# Altium schematic sheet DC.SchDoc: param:Title (part 2 of 3)
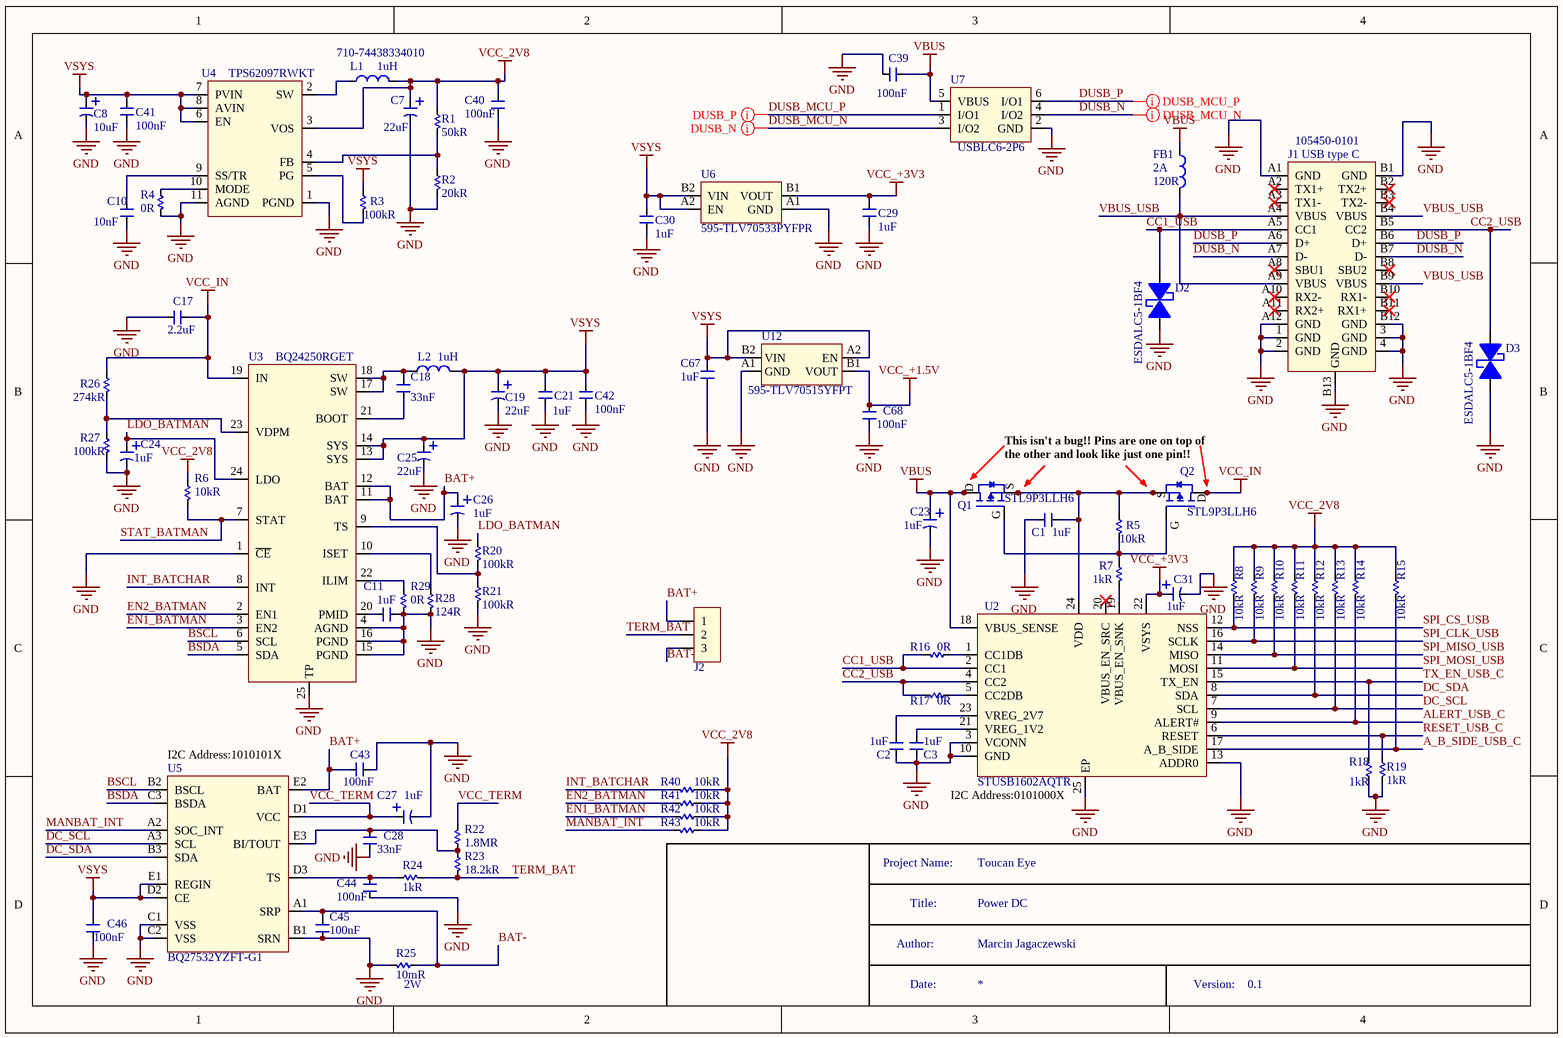
[diagram p1: DC.SchDoc]
## Library data of the parts
C1-C3 C11 C21 C29 C30 C67 = C0402_1uF_TMK105BJ105MV-F: CAP CER 1UF 25V X5R 0402; Manufacturer: Taiyo Yuden; Tolerance: 20%; *PCBChecked: 1; Supplier 1: Mouser; Manufacturer Part Number: TMK105BJ105MV-F; Stock 1: 60117; Pricing 1: 1=0.28, 10=0.098, 50=0.098, 100=0.054, 1000=0.028, 10000=0.019 (USD); Mount: Surface Mount; Case/Package: 0402; Case Code (Metric): 1005; Case Code (Imperial): 0402; Min Operating Temperature: -55°C; Max Operating Temperature: 85°C; Packaging: Tape and Reel; Package Quantity: 1; Voltage Rating (DC): 25V; Dielectric: X5R; Termination: SMD/SMT; Voltage Rating: 25V; Composition: Ceramic; Length: 1mm; Height: 0.5mm; Width: 0.02inch; Thickness: 0.022inch; Depth: 0.5mm; Radiation Hardening: No; Halogen Free: Halogen Free; ComponentLink1URL: https://datasheet.ciiva.com/30154/128tmk105bj105mv-f-30154639.pdf; ComponentLink1Description: https://datasheet.ciiva.com/30154/128tmk105bj105mv-f-30154639.pdf; ComponentLink2URL: https://datasheet.ciiva.com/15922/tmk105bj105mv-f-pdf-15922317.pdf; ComponentLink2Description: https://datasheet.ciiva.com/15922/tmk105bj105mv-f-pdf-15922317.pdf; ComponentLink3URL: https://datasheet.ciiva.com/11596/tmk105bj105mv-f-ss-11596466.pdf; ComponentLink3Description: https://datasheet.ciiva.com/11596/tmk105bj105mv-f-ss-11596466.pdf; ComponentLink4URL: https://datasheet.ciiva.com/13404/mlcc-all-e-541559-13404206.pdf; ComponentLink4Description: https://datasheet.ciiva.com/13404/mlcc-all-e-541559-13404206.pdf; *SCHChecked: 1; Supplier Part Number 1: 963-TMK105BJ105MV-F
C7 C19 C25 = C_22u_TANTAL_A_T491A226K006AT: Cap Tant Solid 22uF 6.3V A CASE 10% (3.2 X 1.6 X 1.6mm) SMD 3216-18 4 Ohm 125C T/R; Manufacturer: KEMET; Dielectric Material: Tantalum; ESR (Equivalent Series Resistance): 4R; Ripple Current: 137mA; Leakage Current: 1.4uA; Polarity: Polar; Dissipation Factor: 6%; Life (Hours): 2000Hour; *PCBChecked: 1; Supplier 1: Mouser; Manufacturer Part Number: T491A226K006AT; Stock 1: 2818; Pricing 1: 1=0.42, 10=0.239, 50=0.239, 100=0.144, 1000=0.118, 10000=0.08 (USD); Mount: Surface Mount,PCB; Case/Package: 1206; Number of Pins: 2; Case Code (Metric): 3216; Case Code (Imperial): 1206; Min Operating Temperature: -55°C; Max Operating Temperature: 125°C; Tolerance: 10%; Packaging: Tape and Reel; Voltage Rating: 6.3V; Package Quantity: 1; Failure Rate: 0.001%; Termination: SMD/SMT; Voltage: 6.3V; Voltage Rating (DC): 6.3V; Length: 3.2mm; Height: 1.6mm; Depth: 1.6mm; Width: 0.063inch; Height - Seated (Max): 0.071inch; Lead Pitch: 1.2mm; Radiation Hardening: No; Lead Free: Lead Free; REACH SVHC: No SVHC; ComponentLink1URL: https://datasheet.ciiva.com/12884/kem-t2005-t491-12884456.pdf; ComponentLink1Description: https://datasheet.ciiva.com/12884/kem-t2005-t491-12884456.pdf; ComponentLink2URL: https://datasheet.ciiva.com/6248/kem-t2005-t491-6248094.pdf; ComponentLink2Description: https://datasheet.ciiva.com/6248/kem-t2005-t491-6248094.pdf; ComponentLink3URL: https://datasheet.ciiva.com/28488/1854511-28488485.pdf; ComponentLink3Description: https://datasheet.ciiva.com/28488/1854511-28488485.pdf; ComponentLink4URL: https://datasheet.ciiva.com/5934/kem-t2005-t491-5934246.pdf; ComponentLink4Description: https://datasheet.ciiva.com/5934/kem-t2005-t491-5934246.pdf; *SCHChecked: 1; Supplier Part Number 1: 80-T491A226K006
C8 = C_10u_TANTAL_A_T491A106K010AT7280: CAP TANT 10UF 10V 10% 1206; Manufacturer: KEMET; ESR (Equivalent Series Resistance): 3.8R; Polarity: Polar; Dissipation Factor: 6%; Life (Hours): 2000Hour; Supplier 1: Mouser; Manufacturer Part Number: T491A106K010AT7280; Stock 1: 0; Pricing 1: 1=0.39, 10=0.223, 50=0.223, 100=0.134, 1000=0.096, 10000=0.074 (USD); Mount: Surface Mount; Case/Package: 1206; Case Code (Metric): 3216; Case Code (Imperial): 1206; Min Operating Temperature: -55°C; Max Operating Temperature: 125°C; Tolerance: 10%; Packaging: Tape and Reel; Voltage Rating: 10V; Package Quantity: 1; Termination: SMD/SMT; Resistance: 3.8R; Failure Rate: 0.001%; Length: 3.2mm; Height: 1.8mm; Depth: 1.6mm; Width: 0.063inch; Height - Seated (Max): 0.071inch; Lead Free: Lead Free; ComponentLink1URL: https://datasheet.ciiva.com/12911/kem-t2005-t491-12911022.pdf; ComponentLink1Description: https://datasheet.ciiva.com/12911/kem-t2005-t491-12911022.pdf; ComponentLink2URL: https://datasheet.ciiva.com/6248/kem-t2005-t491-6248182.pdf; ComponentLink2Description: https://datasheet.ciiva.com/6248/kem-t2005-t491-6248182.pdf; *SCHChecked: *; *PCBChecked: *; Supplier Part Number 1: 80-T491A106K107280
C10 = C0402_10n_C0402C103K4PACTU: .010UF 16.0V; Manufacturer: KEMET; Dielectric Material: Ceramic; Dielectric: X5R; Voltage Rating (DC): 16V; Tolerance: 10%; *SCHChecked: 1; Supplier 1: Mouser; Manufacturer Part Number: C0402C103K4PACTU; Stock 1: 39404; Pricing 1: 1=0.11, 10=0.025, 50=0.025, 100=0.015, 1000=0.01, 10000=0.007 (USD); Case/Package: 0402; Lead Free: Lead Free; ComponentLink1URL: http://www.kemet.com/Lists/ProductCatalog/Attachments/19/KEM_C1006_X5R_SMD.pdf; ComponentLink1Description: http://www.kemet.com/Lists/ProductCatalog/Attachments/19/KEM_C1006_X5R_SMD.pdf; Supplier Part Number 1: 80-C0402C103K4P; *PCBChecked: 1
C17 = C0402_2.2u_GRT155R61E225KE13D: 2.2µF 25V Ceramic Capacitor X5R 0402 (1005 Metric) 0.039" L x 0.020" W (1.00mm x 0.50mm); Manufacturer: Murata; Tolerance: 10%; *SCHChecked: 1; Supplier 1: Mouser; Manufacturer Part Number: GRT155R61E225KE13D; Stock 1: 15349; Mount: Surface Mount; Case/Package: 0402; Case Code (Metric): 1005; Case Code (Imperial): 0402; Min Operating Temperature: -55°C; Max Operating Temperature: 85°C; Packaging: Cut Tape; Voltage Rating: 25V; Dielectric: X5R; Voltage Rating (DC): 25V; Length: 0.039inch; Width: 0.02inch; Thickness: 0.022inch; ComponentLink1URL: http://search.murata.co.jp/Ceramy/image/img/A01X/G101/ENG/GRT155R61E225KE13-01.pdf; ComponentLink1Description: http://search.murata.co.jp/Ceramy/image/img/A01X/G101/ENG/GRT155R61E225KE13-01.pdf; Supplier Part Number 1: 81-GRT155R61E225KE3D; *PCBChecked: 1
C18 C28 = C0402_33n_GCM155R71E333KA55D: Multilayer Ceramic Capacitors MLCC - SMD/SMT .033uF 25Volts 10%; Manufacturer: Murata; Dielectric: X7R; Voltage Rating: 25V; *SCHChecked: 1; Supplier 1: Mouser; Manufacturer Part Number: GCM155R71E333KA55D; Stock 1: 88789; Pricing 1: 1=0.11, 10=0.091, 50=0.091, 100=0.04, 1000=0.023, 10000=0.015 (USD); Mount: Surface Mount; Case/Package: 0402; Case Code (Imperial): 0402; Case Code (Metric): 1005; Min Operating Temperature: -55°C; Max Operating Temperature: 125°C; Tolerance: 10%; Packaging: Tape and Reel; Package Quantity: 10000; Termination: SMD/SMT; Voltage Rating (DC): 25V; Length: 1mm; Height: 0.5mm; Width: 0.02inch; Thickness: 0.022inch; Depth: 0.5mm; Radiation Hardening: No; REACH SVHC: No SVHC; Lead Free: Lead Free; ComponentLink1URL: https://datasheet.ciiva.com/17453/product-17453653.pdf; ComponentLink1Description: https://datasheet.ciiva.com/17453/product-17453653.pdf; ComponentLink2URL: https://datasheet.ciiva.com/16440/s0717e-16440394.pdf; ComponentLink2Description: https://datasheet.ciiva.com/16440/s0717e-16440394.pdf; ComponentLink3URL: https://datasheet.ciiva.com/164/s0717e-164723.pdf; ComponentLink3Description: https://datasheet.ciiva.com/164/s0717e-164723.pdf; Supplier Part Number 1: 81-GCM155R71E333KA5D; *PCBChecked: 1
C23 C24 C26 C27 C31 = C_1u_TANTAL_A_293D105X0025A2TE3: CAP TANT 1UF 25V 20% 1206; Manufacturer: Vishay Sprague; Dielectric Material: Tantalum; ESR (Equivalent Series Resistance): 7.6R; Ripple Current: 100mA; Leakage Current: 500nA; Polarity: Polar; Dissipation Factor: 4%; Voltage Rating (DC): 200kV; *SCHChecked: 1; Supplier 1: Mouser; Manufacturer Part Number: 293D105X0025A2TE3; Stock 1: 4878; Pricing 1: 1=0.17, 10=0.139, 50=0.135, 100=0.131, 1000=0.126, 10000=0.075 (USD); Mount: Surface Mount; Case/Package: 1206; Number of Pins: 2; Case Code (Imperial): 1206; Case Code (Metric): 3216; Min Operating Temperature: -55°C; Max Operating Temperature: 125°C; Tolerance: 20%; Packaging: Tape and Reel; Voltage Rating: 25V; Package Quantity: 2000; Termination: SMD/SMT; Length: 3.2mm; Height: 1.6mm; Width: 1.6mm; Height - Seated (Max): 0.071inch; Depth: 1.6mm; Radiation Hardening: No; REACH SVHC: Unknown; Lead Free: Lead Free; ComponentLink1URL: https://datasheet.ciiva.com/16631/293d-16631739.pdf; ComponentLink1Description: https://datasheet.ciiva.com/16631/293d-16631739.pdf; ComponentLink2URL: https://datasheet.ciiva.com/11245/293d-11245007.pdf; ComponentLink2Description: https://datasheet.ciiva.com/11245/293d-11245007.pdf; ComponentLink3URL: https://datasheet.ciiva.com/22644/1910915-22644415.pdf; ComponentLink3Description: https://datasheet.ciiva.com/22644/1910915-22644415.pdf; ComponentLink4URL: https://datasheet.ciiva.com/16293/293d-16293686.pdf; ComponentLink4Description: https://datasheet.ciiva.com/16293/293d-16293686.pdf; ComponentLink5URL: https://datasheet.ciiva.com/12884/293d-239871-12884008.pdf; ComponentLink5Description: https://datasheet.ciiva.com/12884/293d-239871-12884008.pdf; ComponentLink6URL: https://datasheet.ciiva.com/268/293d-268331.pdf; ComponentLink6Description: https://datasheet.ciiva.com/268/293d-268331.pdf; Supplier Part Number 1: 74-293D105X0025A2TE3; *PCBChecked: 1
C39-C46 C68 = C0201_100n_GRM033R6YA104KE14D: Multilayer Ceramic Capacitors MLCC - SMD/SMT 0201 0.10uF 35volts *Derate Voltage/Temp; Manufacturer: Murata; Tolerance: 10%; Dielectric: X5R; Voltage Rating (DC): 35V; Supplier 1: Mouser; Manufacturer Part Number: GRM033R6YA104KE14D; Stock 1: 295799; Pricing 1: 1=0.1, 10=0.061, 50=0.061, 100=0.027, 1000=0.015, 10000=0.01 (USD); Mount: Surface Mount; Case/Package: 0201; Weight: 1.2E-05oz; Case Code (Metric): 0603; Case Code (Imperial): 0201; Min Operating Temperature: -55°C; Max Operating Temperature: 85°C; Packaging: Tape and Reel; Voltage Rating: 35V; Termination: SMD/SMT; Package Quantity: 15000; Length: 0.024inch; Height: 0.3mm; Width: 0.3mm; Thickness: 0.013inch; ComponentLink1URL: http://www.mouser.com/ds/2/281/c02e-2905.pdf; ComponentLink1Description: http://www.mouser.com/ds/2/281/c02e-2905.pdf; ComponentLink2URL: http://search.murata.co.jp/Ceramy/image/img/A01X/partnumbering_e_01.pdf; ComponentLink2Description: http://search.murata.co.jp/Ceramy/image/img/A01X/partnumbering_e_01.pdf; *SCHChecked: *; *PCBChecked: *; Supplier Part Number 1: 81-GRM33R6YA104KE14D
D2 D3 = ESDALC5-1BF4: ESD Suppressor TVS 30KV 2-Pin Case 0201 T/R; Manufacturer: STMicroelectronics; Direction: Bidirectional; Capacitance: 12pF; Number of Bidirectional Channels: 1; Reverse Standoff Voltage: 5V; Min Breakdown Voltage: 5.8V; Peak Pulse Power: 28W; Power Line Protection: No; Leakage Current: 100nA; Element Configuration: Single; Supplier 1: Mouser; Manufacturer Part Number: ESDALC5-1BF4; Stock 1: 11255; Pricing 1: 1=0.46, 10=0.296, 50=0.296, 100=0.127, 1000=0.098, 10000=0.066 (USD); Mount: Surface Mount; Case/Package: 0201; Number of Pins: 2; Case Code (Metric): 0603; Case Code (Imperial): 0201; Min Operating Temperature: -40°C; Max Operating Temperature: 150°C; Packaging: Tape and Reel; Length: 0.6mm; Depth: 0.3mm; Radiation Hardening: No; ComponentLink1URL: https://datasheet.ciiva.com/48533/dm00078968-48533403.pdf; ComponentLink1Description: https://datasheet.ciiva.com/48533/dm00078968-48533403.pdf; Supplier Part Number 1: 511-ESDALC5-1BF4; *SCHChecked: 1; *PCBChecked: 1
FB1 = BLM18PG-121SN1D: Ferrite Beads Multi-Layer 120Ohm 25% 100MHz 2A 50mOhm DCR 0603 Paper T/R; Manufacturer: Murata; Material: Steel,Ferrite; DC Resistance (DCR): 50mR; Number of Lines: 1; Shielding: Unshielded; Supplier 1: Mouser; Manufacturer Part Number: BLM18PG-121SN1D; Stock 1: 217227; Pricing 1: 1=0.1, 10=0.06, 50=0.06, 100=0.035, 1000=0.025, 10000=0.021 (USD); Case/Package: 0603; Number of Pins: 2; Core Material: Ferrite; Case Code (Metric): 1608; Case Code (Imperial): 0603; Min Operating Temperature: -55°C; Max Operating Temperature: 125°C; Tolerance: 25%; Max DC Current: 2A; Package Quantity: 1; Max Current Rating: 2A; Packaging: Tape and Reel; Current Rating: 2A; Termination: SMD/SMT; Test Frequency: 100MHz; Frequency: 100MHz; Number of Circuits: 1; Length: 1.6mm; Height: 0.8mm; Width: 0.8mm; Depth: 0.8mm; Radiation Hardening: No; REACH SVHC: No SVHC; Lead Free: Lead Free; ComponentLink1URL: https://datasheet.ciiva.com/3854/5emiapbde-1-3854039.pdf; ComponentLink1Description: https://datasheet.ciiva.com/3854/5emiapbde-1-3854039.pdf; ComponentLink2URL: https://datasheet.ciiva.com/11799/0900766b81275ca5-11799546.pdf; ComponentLink2Description: https://datasheet.ciiva.com/11799/0900766b81275ca5-11799546.pdf; ComponentLink3URL: https://datasheet.ciiva.com/19454/1845013-19454715.pdf; ComponentLink3Description: https://datasheet.ciiva.com/19454/1845013-19454715.pdf; ComponentLink4URL: https://datasheet.ciiva.com/5709/1740433-5709171.pdf; ComponentLink4Description: https://datasheet.ciiva.com/5709/1740433-5709171.pdf; ComponentLink5URL: https://datasheet.ciiva.com/29347/442365-da-01-en-chip-drossel-0603-120r-2000ma-1-6x0-8mm-29347911.pdf; ComponentLink5Description: https://datasheet.ciiva.com/29347/442365-da-01-en-chip-drossel-0603-120r-2000ma-1-6x0-8mm-29347911.pdf; ComponentLink6URL: https://datasheet.ciiva.com/14122/blm-series-eng-tds-14122905.pdf; ComponentLink6Description: https://datasheet.ciiva.com/14122/blm-series-eng-tds-14122905.pdf; ComponentLink7URL: https://datasheet.ciiva.com/25903/l0110s0100blm18p-25903483.pdf; ComponentLink7Description: https://datasheet.ciiva.com/25903/l0110s0100blm18p-25903483.pdf; ComponentLink8URL: https://datasheet.ciiva.com/6212/l0110s0100blm18p-6212504.pdf; ComponentLink8Description: https://datasheet.ciiva.com/6212/l0110s0100blm18p-6212504.pdf; ComponentLink9URL: https://datasheet.ciiva.com/6212/l0110s0100blm18p-6212502.pdf; ComponentLink9Description: https://datasheet.ciiva.com/6212/l0110s0100blm18p-6212502.pdf; ComponentLink10URL: https://datasheet.ciiva.com/8021/1740433-8021493.pdf; ComponentLink10Description: https://datasheet.ciiva.com/8021/1740433-8021493.pdf; ComponentLink11URL: https://datasheet.ciiva.com/3081/l0110s0100blm18p-3081632.pdf; ComponentLink11Description: https://datasheet.ciiva.com/3081/l0110s0100blm18p-3081632.pdf; ComponentLink12URL: https://datasheet.ciiva.com/8021/1740433-8021494.pdf; ComponentLink12Description: https://datasheet.ciiva.com/8021/1740433-8021494.pdf; ComponentLink13URL: https://datasheet.ciiva.com/41449/001172297-da-01-en-drossel-0603-120r-1-6x0-8mm-4000st-41449659.pdf; ComponentLink13Description: https://datasheet.ciiva.com/41449/001172297-da-01-en-drossel-0603-120r-1-6x0-8mm-4000st-41449659.pdf; Supplier Part Number 1: 81-BLM18PG121SN1D; *SCHChecked: 1; *PCBChecked: 1
J1 = 105450-0101: MOLEX         105450-0101             USB Connector, USB Type C, USB 3.1, Receptacle, 24 Ways, Surface Mount, Right Angle; Number of Contacts: 24; Number of Ports: 1; USB Standard: USB 3.1; Pitch: 0.5mm; Manufacturer: Molex; Manufacturer Part Number: 105450-0101; Pricing 1: 1=1.87, 10=1.69, 50=1.69, 100=1.54, 1000=1.31, 10000=1.02 (USD); Mount: Surface Mount,Horizontal; Contact Material: Copper Alloy; Contact Plating: Nickel,Gold; Number of Terminals: 24; Housing Material: Thermoplastic; Min Operating Temperature: -30°C; Max Operating Temperature: 85°C; Packaging: Tape and Reel; Gender: Receptacle; Orientation: Right Angle; Termination: Solder; Length: 8.94mm; REACH SVHC: Unknown; ComponentLink1URL: http://www.farnell.com/datasheets/2015275.pdf; ComponentLink1Description: http://www.farnell.com/datasheets/2015275.pdf; ComponentLink2URL: http://www.literature.molex.com/SQLImages/kelmscott/Molex/PDF_Images/987651-4081.PDF; ComponentLink2Description: http://www.literature.molex.com/SQLImages/kelmscott/Molex/PDF_Images/987651-4081.PDF; ComponentLink3URL: http://www.molex.com/pdm_docs/sd/1054500101_sd.pdf; ComponentLink3Description: http://www.molex.com/pdm_docs/sd/1054500101_sd.pdf; Stock 1: 15165; Supplier 1: Mouser; Supplier Part Number 1: 538-105450-0101; *SCHChecked: 1; *PCBChecked: 1
J2 = Goldpin 3x1.27mm NDI: *SCHChecked: 1; *PCBChecked: 1
L1 = L_1u_3x3_74438334010: WURTH ELEKTRONIK         74438334010            Surface Mount Power Inductor, WE-MAPI Series, 1 H,  20%, Shielded, 0.0505 ohm, 2.75 A; Manufacturer: Wurth Electronics; Core Material: Ferrite,Metal,Composite; Current Rating: 2.75A; Saturation Current: 6.6A; Self Resonant Frequency: 80MHz; DC Resistance (DCR): 50.5mR; Test Frequency: 100kHz; Series Resistance: 42.1mR; *SCHChecked: 1; Supplier 1: Mouser; Manufacturer Part Number: 74438334010; Stock 1: 1206; Pricing 1: 1=1.13, 10=1.1, 50=1.03, 100=0.961, 1000=0.813, 10000=0.813 (USD); Mount: Surface Mount; Case/Package: SMD/SMT; Case Code (Metric): 3030; Case Code (Imperial): 1212; Min Operating Temperature: -40°C; Max Operating Temperature: 125°C; Tolerance: 20%; Package Quantity: 1000; Packaging: Tape and Reel; Shielding: Shielded; Inductance Tolerance: 20%; Max DC Current: 2.75A; Termination: SMD/SMT; RMS Current (Irms): 2.75A; Length: 3mm; Height: 1.2mm; Width: 0.118inch; Height - Seated (Max): 0.047inch; Depth: 3mm; REACH SVHC: Unknown; ComponentLink1URL: https://datasheet.ciiva.com/23954/1754798-23954760.pdf; ComponentLink1Description: https://datasheet.ciiva.com/23954/1754798-23954760.pdf; ComponentLink2URL: https://datasheet.ciiva.com/24213/74438334010-268062-24213867.pdf; ComponentLink2Description: https://datasheet.ciiva.com/24213/74438334010-268062-24213867.pdf; ComponentLink3URL: https://datasheet.ciiva.com/29696/74438334010-29696486.pdf; ComponentLink3Description: https://datasheet.ciiva.com/29696/74438334010-29696486.pdf; ComponentLink4URL: https://datasheet.ciiva.com/30489/0900766b812968ea-30489189.pdf; ComponentLink4Description: https://datasheet.ciiva.com/30489/0900766b812968ea-30489189.pdf; ComponentLink5URL: https://datasheet.ciiva.com/29696/74438334010-29696487.pdf; ComponentLink5Description: https://datasheet.ciiva.com/29696/74438334010-29696487.pdf; ComponentLink6URL: https://datasheet.ciiva.com/22748/1754798-22748266.pdf; ComponentLink6Description: https://datasheet.ciiva.com/22748/1754798-22748266.pdf; ComponentLink7URL: https://datasheet.ciiva.com/29696/74438334010-29696488.pdf; ComponentLink7Description: https://datasheet.ciiva.com/29696/74438334010-29696488.pdf; *PCBChecked: 1
L2 = l_1U_3X3_74438336010: WURTH ELEKTRONIK         74438336010             Surface Mount Power Inductor, WE-MAPI Series, 1 H, 4 A, 5 A, Shielded, 0.032 ohm; Manufacturer: Wurth Electronics; Core Material: Ferrite,Metal,Composite; Inductance Tolerance: 20%; Current Rating: 4A; Saturation Current: 5A; DC Resistance (DCR): 32mR; Self Resonant Frequency: 67MHz; Test Frequency: 100kHz; *SCHChecked: 1; Supplier 1: Mouser; Manufacturer Part Number: 74438336010; Stock 1: 604; Pricing 1: 1=1.45, 10=1.4, 50=1.32, 100=1.23, 1000=0.93, 10000=0.832 (USD); Mount: Surface Mount; Case/Package: SMD/SMT; Number of Pins: 2; Case Code (Imperial): 1212; Case Code (Metric): 3030; Min Operating Temperature: -40°C; Max Operating Temperature: 125°C; Packaging: Tape and Reel; Shielding: Shielded; RMS Current (Irms): 4A; Tolerance: 20%; Termination: SMD/SMT; Max DC Current: 4A; Package Quantity: 1000; Length: 0.118inch; Height: 2mm; Width: 0.118inch; Height - Seated (Max): 0.079inch; REACH SVHC: Unknown; ComponentLink1URL: http://www.mouser.com/ds/2/445/74438336010-370092.pdf; ComponentLink1Description: http://www.mouser.com/ds/2/445/74438336010-370092.pdf; ComponentLink2URL: http://www.farnell.com/datasheets/1850891.pdf; ComponentLink2Description: http://www.farnell.com/datasheets/1850891.pdf; Supplier Part Number 1: 710-74438336010; *PCBChecked: 1
Q1 Q2 = STL9P3LLH6: POWER MOSFET; Manufacturer: STMicroelectronics; Drain to Source Voltage (Vdss): 30V; Continuous Drain Current (ID): 9A; Rds On Max: 15mR; Input Capacitance: 2.615nF; Max Power Dissipation: 3W; *PCBChecked: 1; Supplier 1: Mouser; Manufacturer Part Number: STL9P3LLH6; Stock 1: 2202; Pricing 1: 1=0.96, 10=0.812, 50=0.812, 100=0.624, 1000=0.435, 10000=0.372 (USD); Mount: Surface Mount; Number of Pins: 8; Min Operating Temperature: -55°C; Max Operating Temperature: 150°C; Packaging: Tape and Reel; ComponentLink1URL: http://www.st.com/content/ccc/resource/sales_and_marketing/promotional_material/brochure/group0/cb/7a/af/56/f7/bd/47/e9/Brochure%20Power%20management%20guide/files/Brochure_Power_Management.pdf/jcr:content/translations/en.Brochure_Power_Management.pdf; ComponentLink1Description: http://www.st.com/content/ccc/resource/sales_and_marketing/promotional_material/brochure/group0/cb/7a/af/56/f7/bd/47/e9/Brochure%20Power%20management%20guide/files/Brochure_Power_Management.pdf/jcr:content/translations/en.Brochure_Power_Management.pdf; Supplier Part Number 1: 511-STL9P3LLH6; *SCHChecked: 1
R1 = R0402_50k_CRCW040250K0FKED: Thick Film Resistors - SMD 1/16watt 50Kohms 1% Non Standard; Manufacturer: Vishay Dale; Power Rating: 63mW; Voltage Rating: 50V; *SCHChecked: 1; Supplier 1: Mouser; Manufacturer Part Number: CRCW040250K0FKED; Stock 1: 13958; Pricing 1: 1=0.55, 10=0.296, 50=0.296, 100=0.169, 1000=0.119, 10000=0.107 (USD); Case/Package: 0402; Weight: 2.3E-05oz; Case Code (Imperial): 0402; Case Code (Metric): 1005; Min Operating Temperature: -55°C; Max Operating Temperature: 155°C; Tolerance: 1%; Packaging: Tape and Reel; Package Quantity: 10000; Composition: Thick Film; Termination: SMD/SMT; Length: 1mm; Height: 0.35mm; Width: 0.5mm; Lead Free: Lead Free; ComponentLink1URL: https://datasheet.ciiva.com/5600/dcrcwe3-109170-5600763.pdf; ComponentLink1Description: https://datasheet.ciiva.com/5600/dcrcwe3-109170-5600763.pdf; Supplier Part Number 1: 71-CRCW0402-50K-E3; *PCBChecked: 1
R2 = R0402_20k_ERJ-2RKF2002X: Res Thick Film 0402 20K Ohm 1% 0.1W(1/10W) ±100ppm/C Molded SMD Automotive T/R; Manufacturer: Panasonic ECG; Power Rating: 100mW; Voltage Rating: 50V; Temperature Coefficient: 100ppm/°C; *PCBChecked: 1; Supplier 1: Mouser; Manufacturer Part Number: ERJ-2RKF2002X; Stock 1: 605668; Pricing 1: 1=0.15, 10=0.021, 50=0.021, 100=0.012, 1000=0.007, 10000=0.006 (USD); Mount: Surface Mount; Case/Package: 0402; Weight: 2.8E-05oz; Case Code (Metric): 1005; Case Code (Imperial): 0402; Contact Plating: Tin; Min Operating Temperature: -55°C; Max Operating Temperature: 155°C; Tolerance: 1%; Packaging: Cut Tape; Package Quantity: 1; Composition: Thick Film; Number of Terminations: 2; Termination: SMD/SMT; Military Standard: Not; Max Power Dissipation: 100mW; Voltage Rating (DC): 50V; Length: 1mm; Height: 0.35mm; Width: 0.02inch; Depth: 0.5mm; Radiation Hardening: No; REACH SVHC: No SVHC; Lead Free: Lead Free; ComponentLink1URL: https://datasheet.ciiva.com/11821/0900766b80f80784-11821220.pdf; ComponentLink1Description: https://datasheet.ciiva.com/11821/0900766b80f80784-11821220.pdf; ComponentLink2URL: https://datasheet.ciiva.com/24159/aoa0000ce2-24159274.pdf; ComponentLink2Description: https://datasheet.ciiva.com/24159/aoa0000ce2-24159274.pdf; ComponentLink3URL: https://datasheet.ciiva.com/6138/426256-6138761.pdf; ComponentLink3Description: https://datasheet.ciiva.com/6138/426256-6138761.pdf; ComponentLink4URL: https://datasheet.ciiva.com/16508/aoa0000ce2-16508524.pdf; ComponentLink4Description: https://datasheet.ciiva.com/16508/aoa0000ce2-16508524.pdf; ComponentLink5URL: https://datasheet.ciiva.com/30049/aoa0000ce2-30049982.pdf; ComponentLink5Description: https://datasheet.ciiva.com/30049/aoa0000ce2-30049982.pdf; ComponentLink6URL: https://datasheet.ciiva.com/16514/aoa0000ce2-16514269.pdf; ComponentLink6Description: https://datasheet.ciiva.com/16514/aoa0000ce2-16514269.pdf; ComponentLink7URL: https://datasheet.ciiva.com/16782/70260748-16782455.pdf; ComponentLink7Description: https://datasheet.ciiva.com/16782/70260748-16782455.pdf; ComponentLink8URL: https://datasheet.ciiva.com/16762/70260748-16762885.pdf; ComponentLink8Description: https://datasheet.ciiva.com/16762/70260748-16762885.pdf; ComponentLink9URL: https://datasheet.ciiva.com/48531/aoa0000ce2-48531063.pdf; ComponentLink9Description: https://datasheet.ciiva.com/48531/aoa0000ce2-48531063.pdf; ComponentLink10URL: https://datasheet.ciiva.com/46377/426256-46377368.pdf; ComponentLink10Description: https://datasheet.ciiva.com/46377/426256-46377368.pdf; ComponentLink11URL: https://datasheet.ciiva.com/28688/1678782-28688600.pdf; ComponentLink11Description: https://datasheet.ciiva.com/28688/1678782-28688600.pdf; Supplier Part Number 1: 667-ERJ-2RKF2002X; *SCHChecked: 1
R3 R20 R21 R27 = R0402_100k_ERJ-2RKF1003X: Res Thick Film 0402 100K Ohm 1% 0.1W(1/10W) ±100ppm/C Molded SMD Automotive Punched T/R; Manufacturer: Panasonic ECG; Temperature Coefficient: 100ppm/°C; Power Rating: 100mW; Voltage Rating: 50V; *SCHChecked: 1; Supplier 1: Mouser; Manufacturer Part Number: ERJ-2RKF1003X; Stock 1: 1010747; Pricing 1: 1=0.15, 10=0.021, 50=0.021, 100=0.012, 1000=0.007, 10000=0.006 (USD); Mount: Surface Mount; Case/Package: 0402; Number of Pins: 2; Contact Plating: Tin; Case Code (Imperial): 0402; Case Code (Metric): 1005; Min Operating Temperature: -55°C; Max Operating Temperature: 155°C; Tolerance: 1%; Composition: Thick Film; Packaging: Tape and Reel; Package Quantity: 1; Termination: SMD/SMT; Number of Terminations: 2; Military Standard: Not; Max Power Dissipation: 100mW; Voltage Rating (DC): 50V; Length: 1mm; Height: 0.35mm; Width: 0.5mm; Depth: 0.5mm; Radiation Hardening: No; REACH SVHC: No SVHC; Lead Free: Lead Free; ComponentLink1URL: https://datasheet.ciiva.com/11821/0900766b80f80784-11821175.pdf; ComponentLink1Description: https://datasheet.ciiva.com/11821/0900766b80f80784-11821175.pdf; ComponentLink2URL: https://datasheet.ciiva.com/34303/1987038-34303550.pdf; ComponentLink2Description: https://datasheet.ciiva.com/34303/1987038-34303550.pdf; ComponentLink3URL: https://datasheet.ciiva.com/16784/70260748-16784190.pdf; ComponentLink3Description: https://datasheet.ciiva.com/16784/70260748-16784190.pdf; ComponentLink4URL: https://datasheet.ciiva.com/7830/426256-7830974.pdf; ComponentLink4Description: https://datasheet.ciiva.com/7830/426256-7830974.pdf; ComponentLink5URL: https://datasheet.ciiva.com/22723/426256-22723902.pdf; ComponentLink5Description: https://datasheet.ciiva.com/22723/426256-22723902.pdf; ComponentLink6URL: https://datasheet.ciiva.com/48531/aoa0000ce2-48531070.pdf; ComponentLink6Description: https://datasheet.ciiva.com/48531/aoa0000ce2-48531070.pdf; ComponentLink7URL: https://datasheet.ciiva.com/9186/aoa0000ce2-9186687.pdf; ComponentLink7Description: https://datasheet.ciiva.com/9186/aoa0000ce2-9186687.pdf; ComponentLink8URL: https://datasheet.ciiva.com/16778/70260748-16778055.pdf; ComponentLink8Description: https://datasheet.ciiva.com/16778/70260748-16778055.pdf; ComponentLink9URL: https://datasheet.ciiva.com/16522/aoa0000ce2-16522647.pdf; ComponentLink9Description: https://datasheet.ciiva.com/16522/aoa0000ce2-16522647.pdf; ComponentLink10URL: https://datasheet.ciiva.com/7830/aoa0000ce2-7830725.pdf; ComponentLink10Description: https://datasheet.ciiva.com/7830/aoa0000ce2-7830725.pdf; ComponentLink11URL: https://datasheet.ciiva.com/30245/aoa0000ce2-30245691.pdf; ComponentLink11Description: https://datasheet.ciiva.com/30245/aoa0000ce2-30245691.pdf; ComponentLink12URL: https://datasheet.ciiva.com/16440/aoa0000ce2-16440217.pdf; ComponentLink12Description: https://datasheet.ciiva.com/16440/aoa0000ce2-16440217.pdf; ComponentLink13URL: https://datasheet.ciiva.com/43467/1678782-43467480.pdf; ComponentLink13Description: https://datasheet.ciiva.com/43467/1678782-43467480.pdf; Supplier Part Number 1: 667-ERJ-2RKF1003X; *PCBChecked: 1
R4 R29 = R0402_0ohm_RC0402FR-070RL: Thick Film Resistors - SMD 0.0ohm 1%; Manufacturer: Yageo; Power Rating: 62.5mW; Voltage Rating: 50V; Temperature Coefficient: 200ppm/°C; *PCBChecked: 1; Supplier 1: Mouser; Manufacturer Part Number: RC0402FR-070RL; Stock 1: 112632; Pricing 1: 1=0.1, 10=0.01, 50=0.01, 100=0.003, 1000=0.002, 10000=0.002 (USD); Case/Package: 0402; Contact Plating: Tin,Matte; Case Code (Imperial): 0402; Case Code (Metric): 1005; Min Operating Temperature: -55°C; Max Operating Temperature: 155°C; Composition: Thick Film; Tolerance: 1%; Packaging: Tape and Reel; Termination: SMD/SMT; Length: 1mm; Height: 0.35mm; Width: 0.5mm; Radiation Hardening: No; Lead Free: Lead Free; ComponentLink1URL: https://datasheet.ciiva.com/28419/pyu-rc0402-51-rohs-l-6-28419661.pdf; ComponentLink1Description: https://datasheet.ciiva.com/28419/pyu-rc0402-51-rohs-l-6-28419661.pdf; ComponentLink2URL: https://datasheet.ciiva.com/16869/pyu-rc0402-51-rohs-l-6-16869518.pdf; ComponentLink2Description: https://datasheet.ciiva.com/16869/pyu-rc0402-51-rohs-l-6-16869518.pdf; ComponentLink3URL: https://datasheet.ciiva.com/8896/pyu-rc0402-51-rohs-l-6-8896149.pdf; ComponentLink3Description: https://datasheet.ciiva.com/8896/pyu-rc0402-51-rohs-l-6-8896149.pdf; ComponentLink4URL: https://datasheet.ciiva.com/16790/pyu-rc0402-51-rohs-l-6-r-16790444.pdf; ComponentLink4Description: https://datasheet.ciiva.com/16790/pyu-rc0402-51-rohs-l-6-r-16790444.pdf; Supplier Part Number 1: 603-RC0402FR-070RL; *SCHChecked: 1
R5 R6 R8-R15 R40-R43 = R0201_10k_ERJ-1GNF1002C: RESISTOR, 0201, 0.05W, 1%, 10K; Manufacturer: Panasonic ECG; Temperature Coefficient: 200ppm/°C; Power Rating: 50mW; Voltage Rating: 25V; *SCHChecked: 1; Supplier 1: Mouser; Manufacturer Part Number: ERJ-1GNF1002C; Stock 1: 896102; Pricing 1: 1=0.49, 10=0.045, 50=0.045, 100=0.018, 1000=0.013, 10000=0.007 (USD); Mount: Surface Mount; Case/Package: 0201; Number of Pins: 2; Contact Plating: Tin,Matte; Case Code (Metric): 0603; Case Code (Imperial): 0201; Min Operating Temperature: -55°C; Max Operating Temperature: 125°C; Tolerance: 1%; Composition: Thick Film; Packaging: Tape and Reel; Package Quantity: 15000; Number of Terminations: 2; Military Standard: Not; Max Power Dissipation: 50mW; Voltage Rating (DC): 25V; Length: 0.6mm; Height: 0.01inch; Width: 0.012inch; Depth: 0.3mm; Radiation Hardening: No; REACH SVHC: Unknown; Lead Free: Lead Free; ComponentLink1URL: https://datasheet.ciiva.com/16508/aoa0000ce2-16508478.pdf; ComponentLink1Description: https://datasheet.ciiva.com/16508/aoa0000ce2-16508478.pdf; ComponentLink2URL: https://datasheet.ciiva.com/28514/1678782-28514095.pdf; ComponentLink2Description: https://datasheet.ciiva.com/28514/1678782-28514095.pdf; ComponentLink3URL: https://datasheet.ciiva.com/28514/1678782-28514085.pdf; ComponentLink3Description: https://datasheet.ciiva.com/28514/1678782-28514085.pdf; ComponentLink4URL: https://datasheet.ciiva.com/43467/1678782-43467078.pdf; ComponentLink4Description: https://datasheet.ciiva.com/43467/1678782-43467078.pdf; *PCBChecked: 1; Supplier Part Number 1: 667-ERJ-1GNF1002C
R7 R18 R19 R24 = R0201_1k_ERJ-1GNF1001C: RESISTOR, 0201, 0.05W, 1%, 1K; Manufacturer: Panasonic ECG; Temperature Coefficient: 200ppm/°C; Power Rating: 50mW; Voltage Rating: 25V; *SCHChecked: 1; Supplier 1: Mouser; Manufacturer Part Number: ERJ-1GNF1001C; Stock 1: 193064; Pricing 1: 1=0.43, 10=0.039, 50=0.039, 100=0.016, 1000=0.011, 10000=0.006 (USD); Mount: Surface Mount; Case/Package: 0201; Number of Pins: 2; Weight: 6E-06oz; Contact Plating: Tin,Matte; Case Code (Metric): 0603; Case Code (Imperial): 0201; Min Operating Temperature: -55°C; Max Operating Temperature: 125°C; Tolerance: 1%; Composition: Thick Film; Packaging: Tape and Reel; Package Quantity: 15000; Number of Terminations: 2; Max Power Dissipation: 50mW; Termination: SMD/SMT; Voltage Rating (DC): 25V; Length: 0.6mm; Height: 0.01inch; Width: 0.012inch; Radiation Hardening: No; REACH SVHC: Unknown; Lead Free: Lead Free; ComponentLink1URL: https://datasheet.ciiva.com/30263/aoa0000ce2-30263997.pdf; ComponentLink1Description: https://datasheet.ciiva.com/30263/aoa0000ce2-30263997.pdf; ComponentLink2URL: https://datasheet.ciiva.com/28532/1678782-28532076.pdf; ComponentLink2Description: https://datasheet.ciiva.com/28532/1678782-28532076.pdf; ComponentLink3URL: https://datasheet.ciiva.com/43467/1678782-43467054.pdf; ComponentLink3Description: https://datasheet.ciiva.com/43467/1678782-43467054.pdf; ComponentLink4URL: https://datasheet.ciiva.com/15821/erj1gn-15821006.pdf; ComponentLink4Description: https://datasheet.ciiva.com/15821/erj1gn-15821006.pdf; ComponentLink5URL: https://datasheet.ciiva.com/7942/aoa0000ce2-7942424.pdf; ComponentLink5Description: https://datasheet.ciiva.com/7942/aoa0000ce2-7942424.pdf; ComponentLink6URL: https://datasheet.ciiva.com/16437/aoa0000ce2-16437749.pdf; ComponentLink6Description: https://datasheet.ciiva.com/16437/aoa0000ce2-16437749.pdf; ComponentLink7URL: https://datasheet.ciiva.com/24160/aoa0000ce2-24160460.pdf; ComponentLink7Description: https://datasheet.ciiva.com/24160/aoa0000ce2-24160460.pdf; ComponentLink8URL: https://datasheet.ciiva.com/46375/1678782-46375611.pdf; ComponentLink8Description: https://datasheet.ciiva.com/46375/1678782-46375611.pdf; Supplier Part Number 1: 667-ERJ-1GNF1001C; *PCBChecked: 1
R16 R17 = R0201_0_ERJ-1GN0R00C: RES SMD 0.0OHM JUMPER 1/20W 0201; Manufacturer: Panasonic; Power Rating: 50mW; Tolerance: 1%; Voltage Rating: 25V; Temperature Coefficient: 600ppm/°C; *PCBChecked: 1; Supplier 1: Mouser; Manufacturer Part Number: ERJ-1GN0R00C; Stock 1: 835293; Pricing 1: 1=0.21, 10=0.02, 50=0.02, 100=0.008, 1000=0.005, 10000=0.003 (USD); Mount: Surface Mount; Case/Package: 0201; Case Code (Imperial): 0201; Case Code (Metric): 0603; Contact Plating: Tin; Min Operating Temperature: -55°C; Max Operating Temperature: 125°C; Packaging: Tape and Reel; Package Quantity: 15000; Composition: Thick Film; Military Standard: Not; Voltage Rating (DC): 25V; Length: 0.6mm; Height: 0.23mm; Width: 0.3mm; Depth: 0.3mm; REACH SVHC: Unknown; Lead Free: Lead Free; ComponentLink1URL: https://datasheet.ciiva.com/22730/1678796-22730749.pdf; ComponentLink1Description: https://datasheet.ciiva.com/22730/1678796-22730749.pdf; *SCHChecked: 1; Supplier Part Number 1: 667-ERJ-1GN0R00C
R22 = R0402_1.8Mohm_ERJ-2GEJ185X: RESISTOR, THICK FILM, 0402, 1.8MOHM, 5%, 100mW; Manufacturer: Panasonic ECG; Temperature Coefficient: 150ppm/°C; Voltage Rating: 50V; *SCHChecked: 1; Supplier 1: Mouser; Manufacturer Part Number: ERJ-2GEJ185X; Stock 1: 75539; Pricing 1: 1=0.1, 10=0.015, 50=0.015, 100=0.009, 1000=0.006, 10000=0.004 (USD); Mount: Surface Mount; Case/Package: 0402; Contact Plating: Tin; Case Code (Metric): 1005; Case Code (Imperial): 0402; Min Operating Temperature: -55°C; Max Operating Temperature: 155°C; Tolerance: 5%; Composition: Thick Film; Power Rating: 100mW; Packaging: Cut Tape; Package Quantity: 1; Number of Terminations: 2; Military Standard: Not; Max Power Dissipation: 100mW; Voltage Rating (DC): 50V; Length: 1mm; Height: 0.016inch; Width: 0.02inch; Depth: 0.5mm; Radiation Hardening: No; REACH SVHC: No SVHC; ComponentLink1URL: https://datasheet.ciiva.com/8080/aoa0000ce1-8080140.pdf; ComponentLink1Description: https://datasheet.ciiva.com/8080/aoa0000ce1-8080140.pdf; ComponentLink2URL: https://datasheet.ciiva.com/9119/aoa0000ce1-9119071.pdf; ComponentLink2Description: https://datasheet.ciiva.com/9119/aoa0000ce1-9119071.pdf; ComponentLink3URL: https://datasheet.ciiva.com/9197/aoa0000ce1-9197631.pdf; ComponentLink3Description: https://datasheet.ciiva.com/9197/aoa0000ce1-9197631.pdf; ComponentLink4URL: https://datasheet.ciiva.com/30218/4aoa0000ce1-30218742.pdf; ComponentLink4Description: https://datasheet.ciiva.com/30218/4aoa0000ce1-30218742.pdf; ComponentLink5URL: https://datasheet.ciiva.com/43470/1678796-43470038.pdf; ComponentLink5Description: https://datasheet.ciiva.com/43470/1678796-43470038.pdf; ComponentLink6URL: https://datasheet.ciiva.com/46379/1678796-46379142.pdf; ComponentLink6Description: https://datasheet.ciiva.com/46379/1678796-46379142.pdf; Supplier Part Number 1: 667-ERJ-2GEJ185X; *PCBChecked: 1
R23 = R0402_18.2k_ERJ-2RKF1822X: RESISTOR, THICK FILM, 18.2KOHM, 100mW, ± 1%; Manufacturer: Panasonic ECG; Voltage Rating: 50V; Temperature Coefficient: 100ppm/°C; *SCHChecked: 1; Supplier 1: Mouser; Manufacturer Part Number: ERJ-2RKF1822X; Stock 1: 120784; Pricing 1: 1=0.15, 10=0.021, 50=0.021, 100=0.012, 1000=0.007, 10000=0.006 (USD); Mount: Surface Mount; Case/Package: 0402; Case Code (Metric): 1005; Case Code (Imperial): 0402; Contact Plating: Tin; Min Operating Temperature: -55°C; Max Operating Temperature: 155°C; Tolerance: 1%; Packaging: Tape and Reel; Power Rating: 100mW; Package Quantity: 1; Composition: Thick Film; Number of Terminations: 2; Termination: SMD/SMT; Military Standard: Not; Max Power Dissipation: 100mW; Voltage Rating (DC): 50V; Length: 1mm; Height: 0.016inch; Width: 0.02inch; Depth: 0.5mm; REACH SVHC: No SVHC; Lead Free: Lead Free; ComponentLink1URL: https://datasheet.ciiva.com/22682/1678782-22682442.pdf; ComponentLink1Description: https://datasheet.ciiva.com/22682/1678782-22682442.pdf; ComponentLink2URL: https://datasheet.ciiva.com/16765/70260748-16765144.pdf; ComponentLink2Description: https://datasheet.ciiva.com/16765/70260748-16765144.pdf; ComponentLink3URL: https://datasheet.ciiva.com/24026/aoa0000ce2-24026892.pdf; ComponentLink3Description: https://datasheet.ciiva.com/24026/aoa0000ce2-24026892.pdf; ComponentLink4URL: https://datasheet.ciiva.com/43467/1678782-43467421.pdf; ComponentLink4Description: https://datasheet.ciiva.com/43467/1678782-43467421.pdf; ComponentLink5URL: https://datasheet.ciiva.com/16785/70260748-16785165.pdf; ComponentLink5Description: https://datasheet.ciiva.com/16785/70260748-16785165.pdf; ComponentLink6URL: https://datasheet.ciiva.com/7829/1678782-7829303.pdf; ComponentLink6Description: https://datasheet.ciiva.com/7829/1678782-7829303.pdf; ComponentLink7URL: https://datasheet.ciiva.com/46373/1678782-46373814.pdf; ComponentLink7Description: https://datasheet.ciiva.com/46373/1678782-46373814.pdf; ComponentLink8URL: https://datasheet.ciiva.com/9192/aoa0000ce2-9192375.pdf; ComponentLink8Description: https://datasheet.ciiva.com/9192/aoa0000ce2-9192375.pdf; ComponentLink9URL: https://datasheet.ciiva.com/46373/1678782-46373815.pdf; ComponentLink9Description: https://datasheet.ciiva.com/46373/1678782-46373815.pdf; ComponentLink10URL: https://datasheet.ciiva.com/28531/1694929-28531495.pdf; ComponentLink10Description: https://datasheet.ciiva.com/28531/1694929-28531495.pdf; *PCBChecked: 1; Supplier Part Number 1: 667-ERJ-2RKF1822X
R25 = R2512_10m_WW25RR010FTL: WALSIN         WW25RR010FTL             SMD Current Sense Resistor, 0.01 ohm, 2512 [6432 Metric], 2 W,  1%, WW25R Series; Manufacturer: Walsin Technologies; Temperature Coefficient: 75ppm/°C; *SCHChecked: 1; Supplier 1: TME; Manufacturer Part Number: WW25RR010FTL; Stock 1: 8495; Pricing 1: 5=0.2318, 25=0.2073, 100=0.1705, 1000=0.1582, 4000=0.1337 (USD); Case Code (Metric): 6432; Case Code (Imperial): 2512; Packaging: Cut Tape; Composition: Metal Strip; Tolerance: 1%; REACH SVHC: Unknown; ComponentLink1URL: http://www.farnell.com/datasheets/1960328.pdf; ComponentLink1Description: http://www.farnell.com/datasheets/1960328.pdf; Supplier Part Number 1: WW25RR010FTL; *PCBChecked: 1
R26 = R0402_274k_ERJ-2RKF2743X: Res Thick Film 0402 274K Ohm 1% 0.1W(1/10W) ±100ppm/C Molded SMD Automotive Punched T/R; Manufacturer: Panasonic ECG; Power Rating: 100mW; Voltage Rating: 50V; Temperature Coefficient: 100ppm/°C; Supplier 1: Mouser; Manufacturer Part Number: ERJ-2RKF2743X; Stock 1: 108759; Pricing 1: 1=0.15, 10=0.021, 50=0.021, 100=0.012, 1000=0.007, 10000=0.006 (USD); Mount: Surface Mount; Case/Package: 0402; Case Code (Metric): 1005; Case Code (Imperial): 0402; Contact Plating: Tin; Min Operating Temperature: -55°C; Max Operating Temperature: 155°C; Tolerance: 1%; Packaging: Tape and Reel; Package Quantity: 1; Composition: Thick Film; Termination: SMD/SMT; Max Power Dissipation: 100mW; Voltage Rating (DC): 50V; Number of Terminations: 2; Military Standard: Not; Length: 1mm; Height: 0.35mm; Width: 0.02inch; Depth: 0.5mm; REACH SVHC: No SVHC; Lead Free: Lead Free; ComponentLink1URL: https://datasheet.ciiva.com/16766/70260748-16766893.pdf; ComponentLink1Description: https://datasheet.ciiva.com/16766/70260748-16766893.pdf; ComponentLink2URL: https://datasheet.ciiva.com/7853/aoa0000ce2-7853692.pdf; ComponentLink2Description: https://datasheet.ciiva.com/7853/aoa0000ce2-7853692.pdf; ComponentLink3URL: https://datasheet.ciiva.com/43467/1678782-43467519.pdf; ComponentLink3Description: https://datasheet.ciiva.com/43467/1678782-43467519.pdf; ComponentLink4URL: https://datasheet.ciiva.com/24023/aoa0000ce2-24023838.pdf; ComponentLink4Description: https://datasheet.ciiva.com/24023/aoa0000ce2-24023838.pdf; ComponentLink5URL: https://datasheet.ciiva.com/30072/aoa0000ce2-30072587.pdf; ComponentLink5Description: https://datasheet.ciiva.com/30072/aoa0000ce2-30072587.pdf; ComponentLink6URL: https://datasheet.ciiva.com/46373/1678782-46373237.pdf; ComponentLink6Description: https://datasheet.ciiva.com/46373/1678782-46373237.pdf; ComponentLink7URL: https://datasheet.ciiva.com/16772/70260748-16772533.pdf; ComponentLink7Description: https://datasheet.ciiva.com/16772/70260748-16772533.pdf; ComponentLink8URL: https://datasheet.ciiva.com/9183/aoa0000ce2-9183531.pdf; ComponentLink8Description: https://datasheet.ciiva.com/9183/aoa0000ce2-9183531.pdf; ComponentLink9URL: https://datasheet.ciiva.com/22673/1678782-22673766.pdf; ComponentLink9Description: https://datasheet.ciiva.com/22673/1678782-22673766.pdf; *SCHChecked: *; *PCBChecked: *; Supplier Part Number 1: 667-ERJ-2RKF2743X
R28 = R0402_124OHM_ERJ-2RKF1240X: Res Thick Film 0402 124 Ohm 1% 0.1W(1/10W) ±100ppm/C Molded SMD Automotive Punched T/R; Manufacturer: Panasonic ECG; Voltage Rating: 50V; Power Rating: 100mW; Temperature Coefficient: 100ppm/°C; *SCHChecked: 1; Manufacturer Part Number: ERJ-2RKF1240X; Stock 1: 58450; Pricing 1: 1=0.15, 10=0.021, 50=0.021, 100=0.012, 1000=0.007, 10000=0.006 (USD); Mount: Surface Mount; Case/Package: 0402; Case Code (Metric): 1005; Case Code (Imperial): 0402; Contact Plating: Tin; Min Operating Temperature: -55°C; Max Operating Temperature: 155°C; Packaging: Tape and Reel; Tolerance: 1%; Package Quantity: 1; Composition: Thick Film; Number of Terminations: 2; Termination: SMD/SMT; Military Standard: Not; Max Power Dissipation: 100mW; Voltage Rating (DC): 50V; Length: 1mm; Height: 0.35mm; Width: 0.02inch; Depth: 0.5mm; REACH SVHC: Unknown; Lead Free: Lead Free; ComponentLink1URL: https://datasheet.ciiva.com/22682/1678782-22682424.pdf; ComponentLink1Description: https://datasheet.ciiva.com/22682/1678782-22682424.pdf; ComponentLink2URL: https://datasheet.ciiva.com/7942/aoa0000ce2-7942344.pdf; ComponentLink2Description: https://datasheet.ciiva.com/7942/aoa0000ce2-7942344.pdf; ComponentLink3URL: https://datasheet.ciiva.com/43467/1678782-43467230.pdf; ComponentLink3Description: https://datasheet.ciiva.com/43467/1678782-43467230.pdf; ComponentLink4URL: https://datasheet.ciiva.com/16765/70260748-16765596.pdf; ComponentLink4Description: https://datasheet.ciiva.com/16765/70260748-16765596.pdf; ComponentLink5URL: https://datasheet.ciiva.com/46373/1678782-46373831.pdf; ComponentLink5Description: https://datasheet.ciiva.com/46373/1678782-46373831.pdf; ComponentLink6URL: https://datasheet.ciiva.com/46373/1678782-46373830.pdf; ComponentLink6Description: https://datasheet.ciiva.com/46373/1678782-46373830.pdf; ComponentLink7URL: https://datasheet.ciiva.com/9186/aoa0000ce2-9186053.pdf; ComponentLink7Description: https://datasheet.ciiva.com/9186/aoa0000ce2-9186053.pdf; ComponentLink8URL: https://datasheet.ciiva.com/30058/aoa0000ce2-30058295.pdf; ComponentLink8Description: https://datasheet.ciiva.com/30058/aoa0000ce2-30058295.pdf; ComponentLink9URL: https://datasheet.ciiva.com/16764/70260748-16764375.pdf; ComponentLink9Description: https://datasheet.ciiva.com/16764/70260748-16764375.pdf; *PCBChecked: 1; Supplier Part Number 1: 667-ERJ-2RKF1240X; Supplier 1: Mouser
U2 = STUSB1602AQTR: Manufacturer: STMicroelectronics; *SCHChecked: 1; Supplier 1: Mouser; Stock 1: 495; Pricing 1: 1=2.21, 10=1.88, 50=1.88, 100=1.5, 1000=1.09, 10000=0.976 (USD); Supplier Part Number 1: 511-STUSB1602AQTR; *PCBChecked: 1; Manufacturer Part Number: STUSB1602AQTR
U3 = BQ24250RGET: IC BATT CHARGER LI-ION 24VQFN; Manufacturer: Texas Instruments; Output Voltage: 4.44V; Min Supply Voltage: 4.35V; Max Supply Voltage: 10.5V; Output Current: 2A; Max Output Current: 4A; Max Output Voltage: 4.2V; Switching Frequency: 3kHz; Number of Cells: 1; Supplier 1: Mouser; Manufacturer Part Number: BQ24250RGET; Stock 1: 3414; Pricing 1: 1=3.35, 10=3.02, 50=3.02, 100=2.47, 1000=1.78, 10000=1.69 (USD); Mount: Surface Mount; Case/Package: VQFN; Number of Pins: 24; Contact Plating: Nickel,Gold; Min Operating Temperature: -40°C; Max Operating Temperature: 85°C; Package Quantity: 250; Packaging: Tape and Reel; Operating Supply Current: 2A; Length: 4.15mm; Height: 0.95mm; Width: 4.15mm; Radiation Hardening: No; Lead Free: Lead Free; ComponentLink1URL: https://datasheet.ciiva.com/18617/bq24250-18617532.pdf; ComponentLink1Description: https://datasheet.ciiva.com/18617/bq24250-18617532.pdf; ComponentLink2URL: https://datasheet.ciiva.com/30017/bq24250-30017517.pdf; ComponentLink2Description: https://datasheet.ciiva.com/30017/bq24250-30017517.pdf; ComponentLink3URL: https://datasheet.ciiva.com/18617/bq24250-18617531.pdf; ComponentLink3Description: https://datasheet.ciiva.com/18617/bq24250-18617531.pdf; ComponentLink4URL: https://datasheet.ciiva.com/30017/bq24250-30017529.pdf; ComponentLink4Description: https://datasheet.ciiva.com/30017/bq24250-30017529.pdf; ComponentLink5URL: https://datasheet.ciiva.com/18617/bq24250-18617530.pdf; ComponentLink5Description: https://datasheet.ciiva.com/18617/bq24250-18617530.pdf; *SCHChecked: *; *PCBChecked: *; Supplier Part Number 1: 595-BQ24250RGET
U4 = TPS62097RWKT: TEXAS INSTRUMENTS         TPS62097RWKT             DC-DC Switching Buck (Step Down) Regulator, Adj., 2.5V-6Vin, 800mV-6V/2A out, 2.5 MHz, VQFN-11; Quiescent Current: 40uA; Number of Outputs: 1; Min Input Voltage: 2.5V; Max Input Voltage: 6V; Min Output Voltage: 800mV; Output Current: 2A; Switching Frequency: 2.5MHz; Synchronous Rectifier: Yes; Supplier 1: Mouser; Manufacturer: Texas Instruments; Manufacturer Part Number: TPS62097RWKT; Stock 1: 2062; Pricing 1: 1=2.21, 10=1.88, 50=1.88, 100=1.5, 1000=1.09, 10000=0.974 (USD); Mount: Surface Mount; Number of Pins: 11; Min Operating Temperature: -40°C; Max Operating Temperature: 125°C; Packaging: Cut Tape; Max Output Voltage: 6V; Output Voltage: 6V; Lead Free: Lead Free; REACH SVHC: No SVHC; ComponentLink1URL: http://www.ti.com/general/docs/lit/getliterature.tsp?genericPartNumber=TPS62097&&fileType=pdf; ComponentLink1Description: http://www.ti.com/general/docs/lit/getliterature.tsp?genericPartNumber=TPS62097&&fileType=pdf; ComponentLink2URL: http://www.ti.com/lit/gpn/tps62097; ComponentLink2Description: http://www.ti.com/lit/gpn/tps62097; ComponentLink3URL: http://www.ti.com/lit/ds/symlink/tps62097.pdf; ComponentLink3Description: http://www.ti.com/lit/ds/symlink/tps62097.pdf; *SCHChecked: 1; *PCBChecked: 1; Supplier Part Number 1: 595-TPS62097RWKT
U5 = BQ27532YZFT-G1: TEXAS INSTRUMENTS         BQ27532YZFT-G1             BATT GAS GAUGE & CTRL, LI-ION, DSBGA-15; Interface: I2C; Number of Cells: 1; Min Supply Voltage: 2.8V; Max Supply Voltage: 4.5V; Output Voltage: 2.6V; Operating Supply Current: 118uA; Capacity: 14500mAh; Supplier 1: Mouser; Manufacturer: Texas Instruments; Manufacturer Part Number: BQ27532YZFT-G1; Stock 1: 455; Pricing 1: 1=3.26, 10=2.93, 50=2.93, 100=2.4, 1000=1.73, 10000=1.58 (USD); Mount: Surface Mount; Number of Pins: 15; Contact Plating: Copper,Tin,Silver; Min Operating Temperature: -40°C; Max Operating Temperature: 85°C; Package Quantity: 250; Packaging: Tape and Reel; Lead Free: Lead Free; REACH SVHC: No SVHC; ComponentLink1URL: http://www.ti.com/lit/ds/symlink/bq27532-g1.pdf; ComponentLink1Description: http://www.ti.com/lit/ds/symlink/bq27532-g1.pdf; ComponentLink2URL: http://www.ti.com/general/docs/lit/getliterature.tsp?genericPartNumber=BQ27532-G1&&fileType=pdf; ComponentLink2Description: http://www.ti.com/general/docs/lit/getliterature.tsp?genericPartNumber=BQ27532-G1&&fileType=pdf; ComponentLink3URL: http://www.ti.com/general/docs/lit/getliterature.tsp?genericPartNumber=BQ27532-G1&amp;&amp;fileType=pdf; ComponentLink3Description: http://www.ti.com/general/docs/lit/getliterature.tsp?genericPartNumber=BQ27532-G1&amp;&amp;fileType=pdf; ComponentLink4URL: http://www.ti.com/lit/gpn/bq27532-g1; ComponentLink4Description: http://www.ti.com/lit/gpn/bq27532-g1; *SCHChecked: 1; *PCBChecked: 1; Supplier Part Number 1: 595-BQ27532YZFT-G1
U6 = TLV70533PYFPR: Manufacturer: Texas Instruments; Quiescent Current: 30uA; Dropout Voltage: 220mV; *SCHChecked: 1; Supplier 1: Mouser; Manufacturer Part Number: TLV70533PYFPR; Stock 1: 2718; Pricing 1: 1=0.54, 10=0.445, 50=0.445, 100=0.271, 1000=0.21, 10000=0.167 (USD); Min Operating Temperature: -40°C; Max Operating Temperature: 125°C; Lead Free: Lead Free; *PCBChecked: *